# Altium project WS_QTD_v4.0.PrjPcb
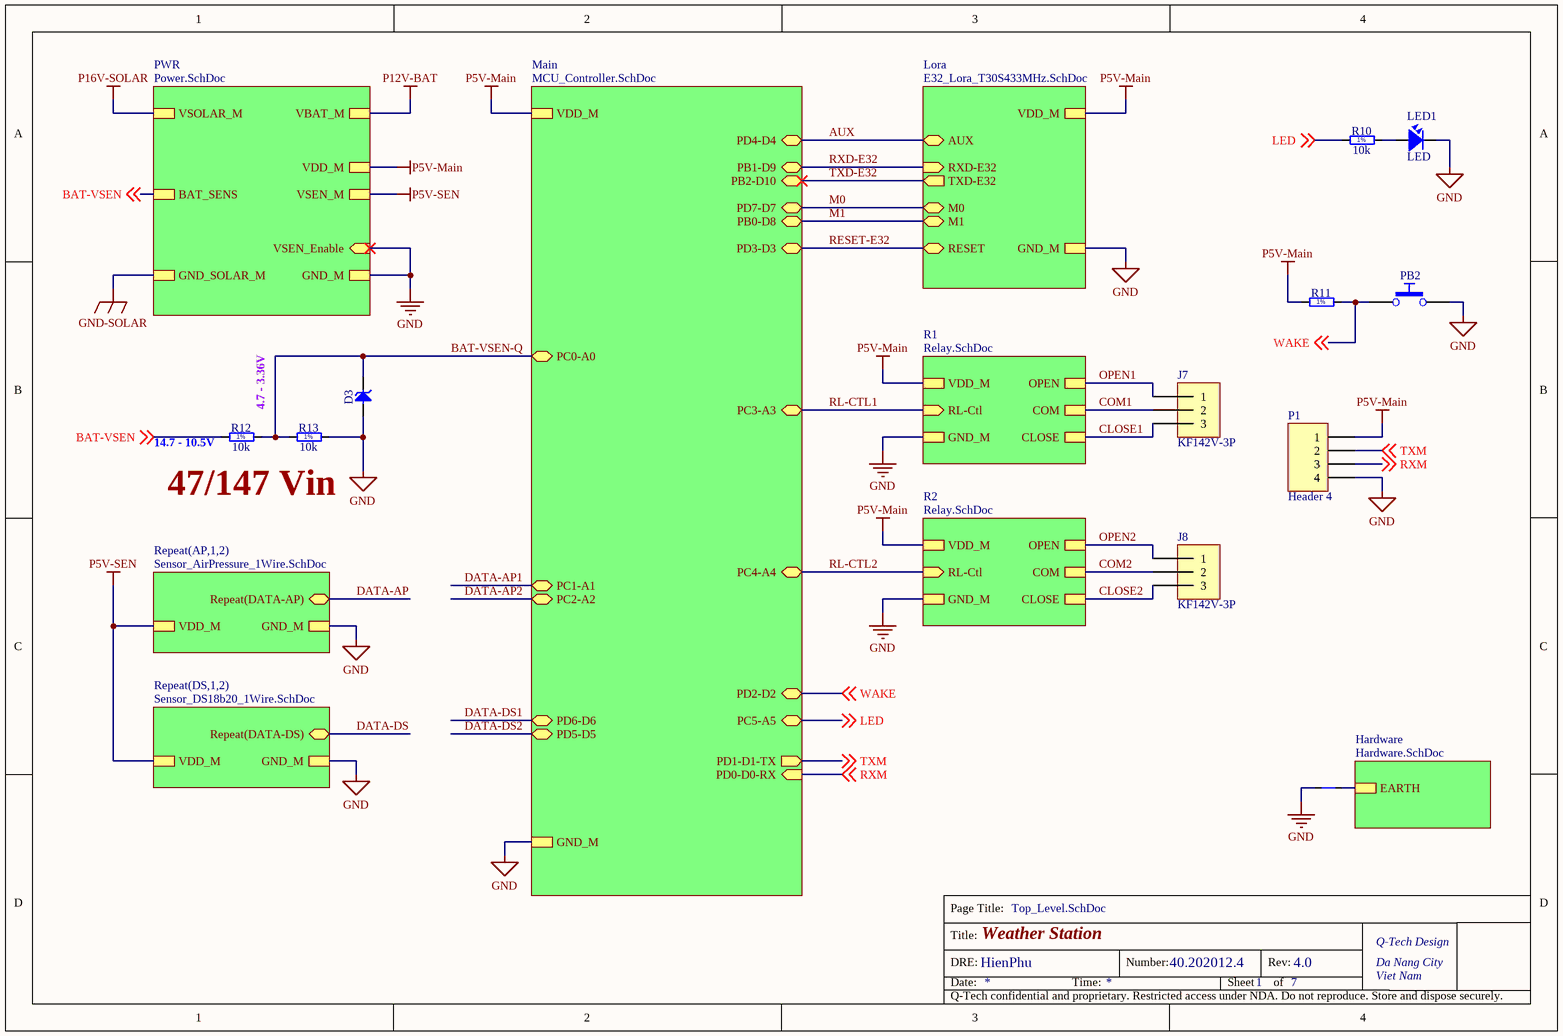
[diagram p0: Top_Level.SchDoc]
DocNumber: 40.202012.4; DRE: HienPhu; ProjectParameterName: Weather Station; Rev: 4.0
8 sheets, 84 parts. Net scope: strictly hierarchical (ports join the sheet entries above them; power ports are local).
Board file: Pcb_WS_v4.PcbDoc
Sheets:
  Top_Level.SchDoc
    Main = MCU_Controller.SchDoc
    Lora = E32_Lora_T30S433MHz.SchDoc
    PWR = Power.SchDoc
    AP1 = Sensor_AirPressure_1Wire.SchDoc
    AP2 = Sensor_AirPressure_1Wire.SchDoc
    DS1 = Sensor_DS18b20_1Wire.SchDoc
    DS2 = Sensor_DS18b20_1Wire.SchDoc
    R1 = Relay.SchDoc
    R2 = Relay.SchDoc
    Hardware = Hardware.SchDoc

## Sheet Top_Level.SchDoc
size A4; Organization: Q-Tech Design; Address1: Da Nang City; Address2: Viet Nam; DocumentNumber: 1; SheetNumber: 1; SheetTotal: 7

### Parts
D3  BZV55-B5V1  [DIOMELF3515N]  (value not drawn)
J7  KF142V-3P  [CON KF142V-3P-5.08]
J8  KF142V-3P  [CON KF142V-3P-5.08]
LED1  LED  [L-0805]
P1  Header 4  [HDR1X4]
PB2  Push Button  [PB_TYCO_FSMSM]  (value not drawn)
R10  10k  [RESC1608X55N]
R11  10k  [RESC1608X55N]  (value not drawn)
R12  10k  [RESC1608X55N]
R13  10k  [RESC1608X55N]
TIE1  TIE  [tie]  (value not drawn)

### Sub-sheets
Hardware = Hardware.SchDoc: EARTH
Lora = E32_Lora_T30S433MHz.SchDoc: M0 (bidir), M1 (bidir), RESET (bidir), AUX (bidir), GND_M, VDD_M, RXD-E32 (in), TXD-E32 (out)
Main = MCU_Controller.SchDoc: PB1-D9 (bidir), PB2-D10 (bidir), GND_M, PC3-A3 (bidir), PB0-D8 (bidir), PD6-D6 (bidir), PD2-D2 (bidir), PC4-A4 (bidir), PD4-D4 (bidir), PC5-A5 (bidir), PC2-A2 (bidir), PD0-D0-RX (in), PD3-D3 (bidir), PC1-A1 (bidir), PD7-D7 (bidir), VDD_M, PD5-D5 (bidir), PC0-A0 (bidir), PD1-D1-TX (out)
PWR = Power.SchDoc: VSOLAR_M, VSEN_Enable (in), BAT_SENS, VSEN_M, GND_SOLAR_M, VBAT_M, GND_M, VDD_M
R1 = Relay.SchDoc: OPEN, GND_M, CLOSE, RL-Ctl (in), VDD_M, COM
R2 = Relay.SchDoc: OPEN, GND_M, CLOSE, RL-Ctl (in), VDD_M, COM
Repeat(AP,1,2) = Sensor_AirPressure_1Wire.SchDoc: VDD_M, GND_M, Repeat(DATA-AP) (bidir)
Repeat(DS,1,2) = Sensor_DS18b20_1Wire.SchDoc: GND_M, Repeat(DATA-DS) (bidir), VDD_M

### Nets
EARTH: TIE1.2 ; sheet Hardware/EARTH
GND: D3.2(A) LED1.2 P1.4 PB2.2 R13.2 TIE1.1 ; sheet Main/GND_M, sheet Lora/GND_M, sheet PWR/VSEN_Enable, sheet PWR/GND_M, sheet Repeat(AP,1,2)/GND_M, sheet Repeat(DS,1,2)/GND_M, sheet R1/GND_M, sheet R2/GND_M
P5V-Main: P1.1 R11.1 ; sheet Main/VDD_M, sheet Lora/VDD_M, sheet PWR/VDD_M, sheet R1/VDD_M, sheet R2/VDD_M
P5V-SEN: sheet PWR/VSEN_M, sheet Repeat(AP,1,2)/VDD_M, sheet Repeat(DS,1,2)/VDD_M
AUX: sheet Main/PD4-D4, sheet Lora/AUX
BAT-VSEN: R12.1 ; off-sheet BAT-VSEN, sheet PWR/BAT_SENS
BAT-VSEN-Q: D3.1(C) R12.2 R13.1 ; sheet Main/PC0-A0
CLOSE1: J7.3 ; sheet R1/CLOSE
CLOSE2: J8.3 ; sheet R2/CLOSE
COM1: J7.2 ; sheet R1/COM
COM2: J8.2 ; sheet R2/COM
DATA-AP: sheet Repeat(AP,1,2)/Repeat(DATA-AP)
DATA-DS: sheet Repeat(DS,1,2)/Repeat(DATA-DS)
LED: R10.1 ; off-sheet LED, sheet Main/PC5-A5
M0: sheet Main/PD7-D7, sheet Lora/M0
M1: sheet Main/PB0-D8, sheet Lora/M1
OPEN1: J7.1 ; sheet R1/OPEN
OPEN2: J8.1 ; sheet R2/OPEN
RESET-E32: sheet Main/PD3-D3, sheet Lora/RESET
RL-CTL1: sheet Main/PC3-A3, sheet R1/RL-Ctl
RL-CTL2: sheet Main/PC4-A4, sheet R2/RL-Ctl
RXD-E32: sheet Main/PB1-D9, sheet Lora/RXD-E32
RXM: P1.3 ; off-sheet RXM, sheet Main/PD0-D0-RX
TXD-E32: sheet Main/PB2-D10, sheet Lora/TXD-E32
TXM: P1.2 ; off-sheet TXM, sheet Main/PD1-D1-TX
WAKE: PB2.1 R11.2 ; off-sheet WAKE, sheet Main/PD2-D2
NetLED1_1: LED1.1 R10.2

### Notes on the sheet
- (near R12) 14.7 - 10.5V
- 4.7 - 3.36V
- 47/147 Vin
- Page Title:
- Date:
- Title:
- DRE:
- Time:
- Number:
- Sheet
- Rev:
- of
- Q-Tech confidential and proprietary. Restricted access under NDA. Do not reproduce. Store and dispose securely.
- (in symbol R0603_1M_1%_0.1W_100PPM) 1%
- (in symbol R0603_2M_1%_0.1W_100PPM) 1%
- (in symbol R0603_10K_1%_0.1W_100PPM) 1%
- (in symbol R0603_200R_1%_0.1W_100PPM) 1%

### Library data of the parts
D3 = BZV55-B5V1: Zener Diode; Part Description: Voltage Regulator Diode; Manufacturer: NXP SEMICONDUCTORS; Voltage: 5V1; Power: 500mW; Table: Diodes; Part Number: BZV55-B5V1; Component Kind: Standard; Component Type: Standard; Device: BZV55-B5V1; PackageDescription: SOD80C, MELF Diode, 2-Leads, Body 3.5x1.5mm, IPC Medium Density; Manufacturer Part Number: BZV55-B5V1; Pin Count: 2; Case: SOD-80C; Mounted: Yes; Socket: No; SMD: Yes; ComponentHeight: 1.6mm; HelpURL: \\cern.ch\dfs\Applications\Altium\Datasheets\BZV55.pdf; Author: CERN DEM JLC; CreateDate: 06-May-08; LatestRevisionDate: 06-May-08
J7 J8 = CON KF142V-3P-5.08
LED1 = LED: LED Single colour Green and Red; Value: LED 3 ly Single Colour
P1 = Header 4: Header, 4-Pin; LatestRevisionDate: 17-Jul-2002; LatestRevisionNote: Re-released for DXP Platform.; Publisher: Altium Limited
PB2 = PB SPST 1NO-2NO: Push-Button Switch SPDT; Part Description: 12VDC 50mA SPST Tactile  Push-Button Switch; Manufacturer: TYCO ELECTRONICS; Manufacturer Part Number: FSMSM or 1437566-3; Table: Switches; Part Number: PB_TYCO_FSMSM; Component Kind: Standard; Component Type: Standard; Pin Count: 2; PackageDescription: Body 3.5x6.0mm, Pushbutton Switch,  TYCO ALCOSWITCH FSMSM Serie; Family: Push Button; Mounted: Yes; Socket: No; SMD: Yes; Status: None; ComponentHeight: 4.3mm; HelpURL: \\cern.ch\dfs\Applications\Altium\Datasheets\PB_TYCO_FSMSM.pdf; Author: CERN DEM JLC; CreateDate: 6/30/2008; LatestRevisionDate: 6/21/2012
R10 = R0603_200R_1%_0.1W_100PPM: Resistor - 1%; Part Description: General Purpose Thick Film Chip Resistor; Manufacturer: GENERIC; Manufacturer1 Part Number: NRC06F2000TRF; Value: 200; Power: 0.1W; TC: ±100ppm/°C; Table: Resistors SMD; Part Number: R0603_200R_1%_0.1W_100PPM; Component Kind: Standard; Component Type: Standard; Pin Count: 2; Status: Preferred; Tolerance: ±1%; Manufacturer Part Number: R0603_200R_1%_0.1W_100PPM; Case: 0603; Mounted: Yes; Socket: No; SMD: Yes; Manufacturer1 Example: NIC COMPONENT; Manufacturer1 ComponentHeight: 0.55mm; HelpURL: \\cern.ch\dfs\Applications\Altium\Datasheets\R0603_NIC_NRC.pdf; Author: CERN DEM JLC; CreateDate: 03-Dec-07; LatestRevisionDate: 13-Mar-08
R11 = R0603_10K_1%_0.1W_100PPM: Resistor - 1%; Part Description: General Purpose Thick Film Chip Resistor; Manufacturer: GENERIC; Manufacturer1 Part Number: NRC06F1002TRF; Power: 0.1W; TC: ±100ppm/°C; Table: Resistors SMD; Part Number: R0603_10K_1%_0.1W_100PPM; Component Kind: Standard; Component Type: Standard; Pin Count: 2; Value: 10k; Status: Preferred; Tolerance: ±1%; Manufacturer Part Number: R0603_10K_1%_0.1W_100PPM; Case: 0603; Mounted: Yes; Socket: No; SMD: Yes; Manufacturer1 Example: NIC COMPONENT; Manufacturer1 ComponentHeight: 0.55mm; HelpURL: \\cern.ch\dfs\Applications\Altium\Datasheets\R0603_NIC_NRC.pdf; Author: CERN DEM JLC; CreateDate: 03-Dec-07; LatestRevisionDate: 13-Mar-08
R12 = R0603_2M_1%_0.1W_100PPM: Resistor - 1%; Part Description: General Purpose Thick Film Chip Resistor; Manufacturer: GENERIC; Manufacturer1 Part Number: NRC06F2004TRF; Value: 2M; Power: 0.1W; TC: ±100ppm/°C; Table: Resistors SMD; Part Number: R0603_2M_1%_0.1W_100PPM; Component Kind: Standard; Component Type: Standard; Pin Count: 2; Status: Preferred; Tolerance: ±1%; Manufacturer Part Number: R0603_2M_1%_0.1W_100PPM; Case: 0603; Mounted: Yes; Socket: No; SMD: Yes; Manufacturer1 Example: NIC COMPONENT; Manufacturer1 ComponentHeight: 0.55mm; HelpURL: \\cern.ch\dfs\Applications\Altium\Datasheets\R0603_NIC_NRC.pdf; Author: CERN DEM JLC; CreateDate: 03-Dec-07; LatestRevisionDate: 13-Mar-08
R13 = R0603_1M_1%_0.1W_100PPM: Resistor - 1%; Part Description: General Purpose Thick Film Chip Resistor; Manufacturer: GENERIC; Manufacturer1 Part Number: NRC06F1004TRF; Value: 1M; Power: 0.1W; TC: ±100ppm/°C; Table: Resistors SMD; Part Number: R0603_1M_1%_0.1W_100PPM; Component Kind: Standard; Component Type: Standard; Pin Count: 2; Status: Preferred; Tolerance: ±1%; Manufacturer Part Number: R0603_1M_1%_0.1W_100PPM; Case: 0603; Mounted: Yes; Socket: No; SMD: Yes; Manufacturer1 Example: NIC COMPONENT; Manufacturer1 ComponentHeight: 0.55mm; HelpURL: \\cern.ch\dfs\Applications\Altium\Datasheets\R0603_NIC_NRC.pdf; Author: CERN DEM JLC; CreateDate: 03-Dec-07; LatestRevisionDate: 13-Mar-08

## Sheet MCU_Controller.SchDoc
size A4; Organization: Q-Tech Design; Address1: Da Nang City; Address2: Viet Nam; DocumentNumber: 2; SheetNumber: 2; SheetTotal: 7
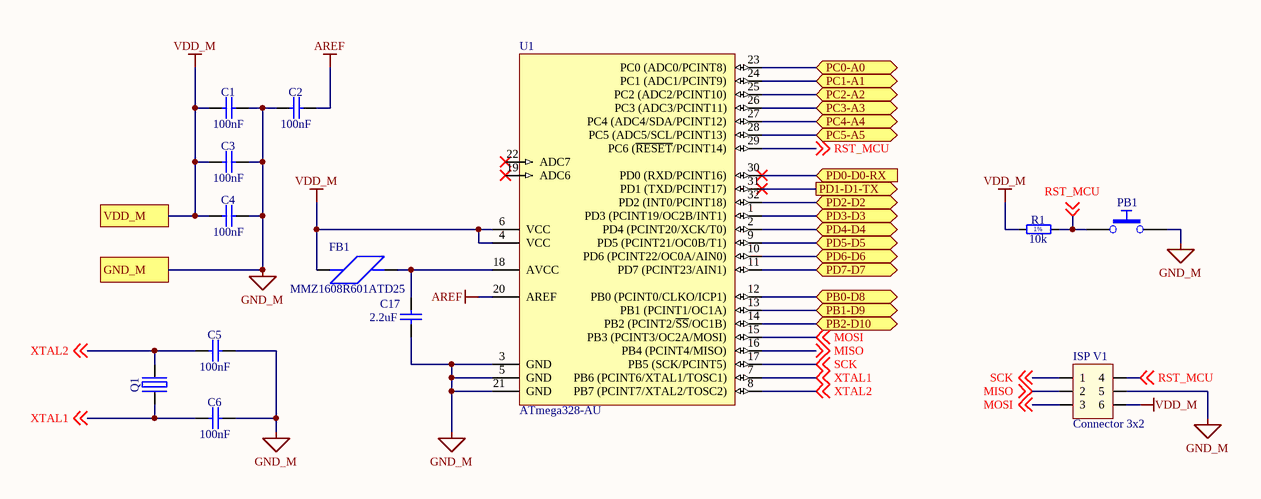
[diagram p1: MCU_Controller.SchDoc]

### Parts
C1  100nF  [CAPC1608X87N]
C2  100nF  [CAPC1608X87N]
C3  100nF  [CAPC1608X87N]
C4  100nF  [CAPC1608X87N]
C5  100nF  [CAPC1608X87N]
C6  100nF  [CAPC1608X87N]
C17  2.2uF  [CAPC1608X87N]
FB1  Manufacturer Part Number: MMZ1608R601ATD25  [Chip_0603]  (hidden comment: Ferrite bead Case 0603)
ISP_V1  Connector 3x2  [JP3x2]
PB1  Push Button  [PB_TYCO_FSMSM]  (value not drawn)
Q1  20MHz  [XTAL_HC-49/U]  (value not drawn)
R1  10k  [RESC1608X55N]
U1  ATmega328-AU  [32A_ATM-M]

### Ports
GND_M, PB0-D8 (bidir), PB1-D9 (bidir), PB2-D10 (bidir), PC0-A0 (bidir), PC1-A1 (bidir), PC2-A2 (bidir), PC3-A3 (bidir), PC4-A4 (bidir), PC5-A5 (bidir), PD0-D0-RX (in), PD1-D1-TX (out), PD2-D2 (bidir), PD3-D3 (bidir), PD4-D4 (bidir), PD5-D5 (bidir), PD6-D6 (bidir), PD7-D7 (bidir), VDD_M

### Nets
AREF: C2.2 U1.20(AREF)
GND_M: C1.2 C2.1 C3.2 C4.2 C5.2 C6.2 C17.1 ISP_V1.5 PB1.2 U1.3(GND) U1.5(GND) U1.21(GND) ; port GND_M  [project net GND]
VDD_M: C1.1 C3.1 C4.1 FB1.1 ISP_V1.6 R1.1 U1.4(VCC) U1.6(VCC) ; port VDD_M  [project net P5V-Main]
AUX: U1.2(PD4_(PCINT20/XCK/T0)) ; port PD4-D4
BAT-VSEN-Q: U1.23(PC0_(ADC0/PCINT8)) ; port PC0-A0
DATA-AP1: U1.24(PC1_(ADC1/PCINT9)) ; port PC1-A1
DATA-AP2: U1.25(PC2_(ADC2/PCINT10)) ; port PC2-A2
DATA-DS1: U1.10(PD6_(PCINT22/OC0A/AIN0)) ; port PD6-D6
DATA-DS2: U1.9(PD5_(PCINT21/OC0B/T1)) ; port PD5-D5
LED: U1.28(PC5_(ADC5/SCL/PCINT13)) ; port PC5-A5
M0: U1.11(PD7_(PCINT23/AIN1)) ; port PD7-D7
M1: U1.12(PB0_(PCINT0/CLKO/ICP1)) ; port PB0-D8
MISO: ISP_V1.2 U1.16(PB4_(PCINT4/MISO)) ; off-sheet MISO
MOSI: ISP_V1.3 U1.15(PB3_(PCINT3/OC2A/MOSI)) ; off-sheet MOSI
RESET-E32: U1.1(PD3_(PCINT19/OC2B/INT1)) ; port PD3-D3
RL-CTL1: U1.26(PC3_(ADC3/PCINT11)) ; port PC3-A3
RL-CTL2: U1.27(PC4_(ADC4/SDA/PCINT12)) ; port PC4-A4
RST_MCU: ISP_V1.4 PB1.1 R1.2 U1.29(PC6_(~{RESET}/PCINT14)) ; off-sheet RST_MCU
RXD-E32: U1.13(PB1_(PCINT1/OC1A)) ; port PB1-D9
RXM: U1.30(PD0_(RXD/PCINT16)) ; port PD0-D0-RX
SCK: ISP_V1.1 U1.17(PB5_(SCK/PCINT5)) ; off-sheet SCK
TXD-E32: U1.14(PB2_(PCINT2/~{SS}/OC1B)) ; port PB2-D10
TXM: U1.31(PD1_(TXD/PCINT17)) ; port PD1-D1-TX
WAKE: U1.32(PD2_(INT0/PCINT18)) ; port PD2-D2
XTAL1: C6.1 Q1.1(OSC1) U1.7(PB6_(PCINT6/XTAL1/TOSC1)) ; off-sheet XTAL1
XTAL2: C5.1 Q1.2(OSC2) U1.8(PB7_(PCINT7/XTAL2/TOSC2)) ; off-sheet XTAL2
NetC17_2: C17.2 FB1.2 U1.18(AVCC)

Not connected (* = marked no-connect by the designer): U1 19(ADC6)* 22(ADC7)*

### Notes on the sheet
- Page Title:
- Date:
- Title:
- DRE:
- Time:
- Number:
- Sheet
- Rev:
- of
- Q-Tech confidential and proprietary. Restricted access under NDA. Do not reproduce. Store and dispose securely.
- (in symbol R0603_10K_1%_0.1W_100PPM) 1%

### Library data of the parts
C1-C4 = CC0603_100NF_50V_10%_X7R: Non-polarised capacitor; Part Description: SMD Multilayer Chip Ceramic Capacitor; Manufacturer: GENERIC; Manufacturer1 Part Number: 223858615649; Voltage: 50V; TC: X7R; Tolerance: ±10%; Table: Capacitors SMD; Part Number: CC0603_100NF_50V_10%_X7R; Component Kind: Standard; Component Type: Standard; Pin Count: 2; Value: 100nF; Status: Preferred; Manufacturer Part Number: CC0603_100NF_50V_10%_X7R; Case: 0603; Mounted: Yes; Socket: No; SMD: Yes; Manufacturer1 Example: PHYCOMP; Manufacturer1 ComponentHeight: 0.87mm; HelpURL: \\cern.ch\dfs\Applications\Altium\Datasheets\CC0603_X7R_PHYCOMP.pdf; Author: CERN DEM JLC; CreateDate: 03-Dec-07; LatestRevisionDate: 03-Dec-07
C5 C6 = CC0603_22PF_50V_5%_NP0: Non-polarised capacitor; Part Description: SMD Multilayer Chip Ceramic Capacitor; Manufacturer: GENERIC; Manufacturer1 Part Number: 223886715229; Value: 22pF; Voltage: 50V; TC: NP0; Tolerance: ±5%; Table: Capacitors SMD; Part Number: CC0603_22PF_50V_5%_NP0; Component Kind: Standard; Component Type: Standard; Pin Count: 2; Status: Preferred; Manufacturer Part Number: CC0603_22PF_50V_5%_NP0; Case: 0603; Mounted: Yes; Socket: No; SMD: Yes; Manufacturer1 Example: PHYCOMP; Manufacturer1 ComponentHeight: 0.87mm; HelpURL: \\cern.ch\dfs\Applications\Altium\Datasheets\CC0603_NP0_PHYCOMP.pdf; Author: CERN DEM JLC; CreateDate: 03-Dec-07; LatestRevisionDate: 03-Dec-07
C17 = CC0603_2.2UF_16V_10%_X5R: Non-polarised capacitor; Part Description: SMD Multilayer Chip Ceramic Capacitor; Manufacturer: GENERIC; Manufacturer1 Part Number: CC0603KRX5R7BB225; Voltage: 16V; TC: X5R; Tolerance: ±10%; Table: Capacitors SMD; Part Number: CC0603_2.2UF_16V_10%_X5R; Component Kind: Standard; Component Type: Standard; Pin Count: 2; Value: 2.2uF; Status: Preferred; Manufacturer Part Number: CC0603_2.2UF_16V_10%_X5R; Case: 0603; Mounted: Yes; Socket: No; SMD: Yes; Manufacturer1 Example: YAGEO; Manufacturer1 ComponentHeight: 0.9mm; HelpURL: \\cern.ch\dfs\Applications\Altium\Datasheets\CC0805_X5R_PHYCOMP_HC.pdf; Author: CERN DEM JLC; CreateDate: 28-Apr-11; LatestRevisionDate: 28-Apr-11
FB1 = FERRITE_0603
ISP_V1 = JP3x2: Value: Connector 3x2
PB1 = PB SPST 1NO-2NO: as PB2 on sheet Top_Level; Part Number: PB_TYCO_FSMSM; Component Kind: Standard; Component Type: Standard; Pin Count: 2; PackageDescription: Body 3.5x6.0mm, Pushbutton Switch,  TYCO ALCOSWITCH FSMSM Serie; Family: Push Button; Mounted: Yes; Socket: No; SMD: Yes; Status: None; ComponentHeight: 4.3mm; HelpURL: \\cern.ch\dfs\Applications\Altium\Datasheets\PB_TYCO_FSMSM.pdf; Author: CERN DEM JLC; CreateDate: 6/30/2008; LatestRevisionDate: 6/21/2012
Q1 = XTAL_20MHZ_AEL_HC-49/U: Quartz Crystal; Part Description: ±30ppm Quartz Crystal Resonator, HC-49/U Type; Manufacturer: AEL CRYSTALS; Manufacturer Part Number: X20M000000L010; Table: Crystals & Oscillators; Part Number: XTAL_20MHZ_AEL_HC-49/U; Component Kind: Standard; Component Type: Standard; PackageDescription: HC-49/U Leaded Cristal, Body 11.05x4.8mm; Pitch 4.88mm; Value: 20MHz; Pin Count: 2; Mounted: Yes; Socket: No; SMD: No; ComponentHeight: 13.6mm; HelpURL: \\cern.ch\dfs\Applications\Altium\Datasheets\XTAL_AEL_HC-49-U.pdf; Author: CERN DEM JMW; CreateDate: 31-Oct-08; LatestRevisionDate: 13-May-11
R1 = R0603_10K_1%_0.1W_100PPM: as R11 on sheet Top_Level; Part Number: R0603_10K_1%_0.1W_100PPM; Component Kind: Standard; Component Type: Standard; Pin Count: 2; Value: 10k; Status: Preferred; Tolerance: ±1%; Manufacturer Part Number: R0603_10K_1%_0.1W_100PPM; Case: 0603; Mounted: Yes; Socket: No; SMD: Yes; Manufacturer1 Example: NIC COMPONENT; Manufacturer1 ComponentHeight: 0.55mm; HelpURL: \\cern.ch\dfs\Applications\Altium\Datasheets\R0603_NIC_NRC.pdf; Author: CERN DEM JLC; CreateDate: 03-Dec-07; LatestRevisionDate: 13-Mar-08
U1 = ATmega328-AU: 8-bit AVR Microcontroller, 32KB Flash, 1KB EEPROM, 2KB SRAM, 32-pin TQFP, Industrial Grade (-40°C to 85°C); Published: 1-Apr-2010; DatasheetVersion: revA, Jan-2010; PackageVersion: revB, Oct-2001; PackageReference: 32A; Publisher: Altium Limited; PackageDescription: 32-Lead, 7x7x1.0 mm Body, 0.8mm Lead Pitch, Thin Profile Plastic Quad Flat Package (TQFP); Supplier 1: Digi-Key; Supplier Part Number 1: ATMEGA328-AU-ND; Supplier 2: Mouser; Supplier Part Number 2: 556-ATMEGA328-AU; Code_JEDEC: MS-026-ABA; ComponentLink1Description: Manufacturer Link; ComponentLink1URL: http://www.atmel.com/products/avr/default.asp?; ComponentLink2Description: ATmega48A/48PA/88A/88PA/168A/168PA/328/328P Datasheet; ComponentLink2URL: http://www.atmel.com/dyn/resources/prod_documents/8271.pdf; ComponentLink3Description: ATmega48A/48PA/88A/88PA/168A/168PA/328/328P Summary; ComponentLink3URL: http://www.atmel.com/dyn/resources/prod_documents/8271S.pdf; ComponentLink4Description: Atmel.com Home; ComponentLink4URL: http://www.atmel.com

## Sheet E32_Lora_T30S433MHz.SchDoc
size A4; Organization: Q-Tech Design; Address1: Da Nang City; Address2: Viet Nam; DocumentNumber: 3; SheetNumber: 3; SheetTotal: 7
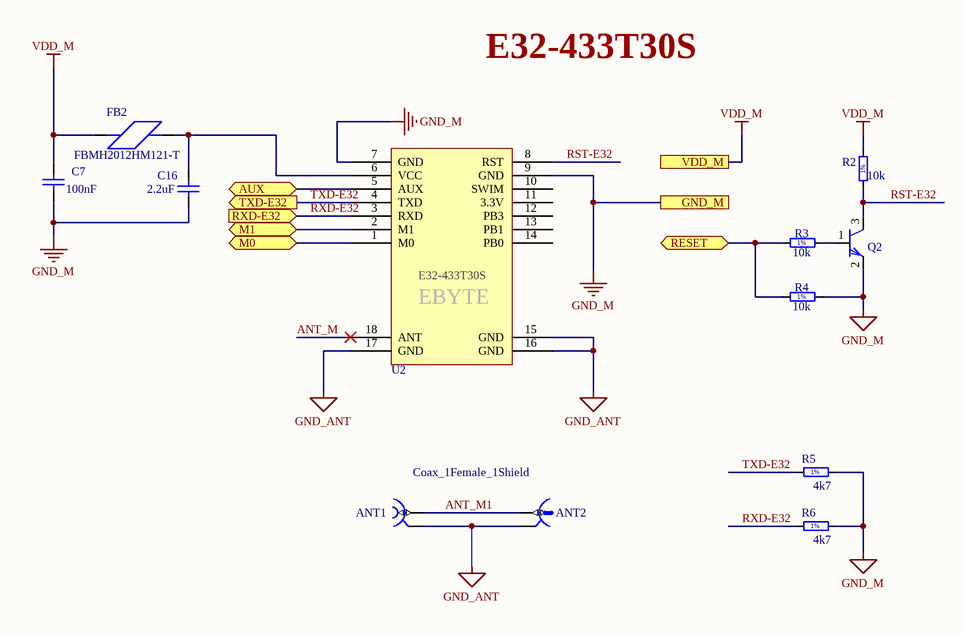
[diagram p2: E32_Lora_T30S433MHz.SchDoc]

### Parts
ANT1  Coax_1Female_1Shield  [HUBER-SUHNER_85 SMA-50-0-101/111 NE]
ANT2  U.FL  [HIROSE_U.FL-R-SMT-1(10)]  (value not drawn)
C7  100nF  [CAPC1608X87N]
C16  2.2uF  [CAPC1608X87N]
FB2  Manufacturer Part Number: FBMH2012HM121-T  [CHIP_0805]  (hidden comment: Ferrite bead Case 0805)
Q2  C1815  [SOT23-3]  (value not drawn)
R2  10k  [RESC1608X55N]
R3  10k  [RESC1608X55N]
R4  10k  [RESC1608X55N]
R5  4k7  [RESC1608X55N]
R6  4k7  [RESC1608X55N]
U2  E32-T30S  [E32-T30S]  (value not drawn)

### Ports
AUX (bidir), GND_M, M0 (bidir), M1 (bidir), RESET (bidir), RXD-E32 (in), TXD-E32 (out), VDD_M

### Nets
GND_ANT: ANT1.2 ANT2.2 U2.15(GND) U2.16(GND) U2.17(GND)
GND_M: C7.1 C16.1 Q2.2(E) R4.1 R5.2 R6.2 U2.7(GND) U2.9(GND) ; port GND_M  [project net GND]
VDD_M: C7.2 FB2.1 R2.2 ; port VDD_M  [project net P5V-Main]
ANT_M: U2.18(ANT)
ANT_M1: ANT1.1 ANT2.1
AUX: U2.5(AUX) ; port AUX
M0: U2.1(M0) ; port M0
M1: U2.2(M1) ; port M1
RESET-E32: R3.1 R4.2 ; port RESET
RST-E32: Q2.3(C) R2.1 U2.8(RST)
RXD-E32: R6.1 U2.3(RXD) ; port RXD-E32
TXD-E32: R5.1 U2.4(TXD) ; port TXD-E32
NetC16_2: C16.2 FB2.2 U2.6(VCC)
NetQ2_1: Q2.1(B) R3.2

Not connected (* = marked no-connect by the designer): U2 10(SWIM) 11(3.3V) 12(PB3) 13(PB1) 14(PB0)

### Notes on the sheet
- E32-433T30S
- Page Title:
- Date:
- Title:
- DRE:
- Time:
- Number:
- Sheet
- Rev:
- of
- Q-Tech confidential and proprietary. Restricted access under NDA. Do not reproduce. Store and dispose securely.
- (in symbol E32-433T30S) EBYTE
- (in symbol R0603_1K_1%_0.1W_100PPM) 1%
- (in symbol R0603_4K7_1%_0.1W_100PPM) 1%
- (in symbol R0603_10K_1%_0.1W_100PPM) 1%

### Library data of the parts
ANT1 = HUBER-SUHNER_85_SMA-50-0-101/111_NE: Part Description: SMA 50 Ohms Right Angle PCB Jack; Manufacturer: HUBER+SUHNER; Table: Miscellaneous; Part Number: HUBER-SUHNER_85_SMA-50-0-101/111_NE; Component Kind: Standard; Component Type: Standard; Pin Count: 2; Family: SMA; Mounted: Yes; Socket: No; SMD: No; Status: None; Manufacturer Part Number: 85_SMA-50-0-101/111_NE; ComponentHeight: 9.6mm; HelpURL: \\cern.ch\dfs\Applications\Altium\Datasheets\HUBER-SUHNER_85 SMA-50-0-101-111 NE.pdf; Author: CERN DEM JLC; CreateDate: 20-Apr-10; LatestRevisionDate: 27-Apr-10
ANT2 = HIROSE_U.FL-R-SMT-1(10): Part Description: Up to 6GHz Ultra Small Surface Mount Male Coaxial Connectors U.FL Series; Manufacturer: HIROSE (HRS); Table: Miscellaneous; Part Number: HIROSE_U.FL-R-SMT-1(10); Component Kind: Standard; Component Type: Standard; Pin Count: 2; Family: U.FL; Mounted: Yes; Socket: No; SMD: Yes; Status: None; Manufacturer Part Number: U.FL-R-SMT-1(10); ComponentHeight: 1.25mm; HelpURL: \\cern.ch\dfs\Applications\Altium\Datasheets\HIROSE_U.FL-R-SMT-1(10).pdf; Author: CERN DEM JLC; CreateDate: 24-Mar-10; LatestRevisionDate: 24-Mar-10
C7 = CC0603_100NF_50V_10%_X7R: as C1 on sheet MCU_Controller; Part Number: CC0603_100NF_50V_10%_X7R; Component Kind: Standard; Component Type: Standard; Pin Count: 2; Value: 100nF; Status: Preferred; Manufacturer Part Number: CC0603_100NF_50V_10%_X7R; Case: 0603; Mounted: Yes; Socket: No; SMD: Yes; Manufacturer1 Example: PHYCOMP; Manufacturer1 ComponentHeight: 0.87mm; HelpURL: \\cern.ch\dfs\Applications\Altium\Datasheets\CC0603_X7R_PHYCOMP.pdf; Author: CERN DEM JLC; CreateDate: 03-Dec-07; LatestRevisionDate: 03-Dec-07
C16 = CC0603_2.2UF_16V_10%_X5R: as C17 on sheet MCU_Controller; Part Number: CC0603_2.2UF_16V_10%_X5R; Component Kind: Standard; Component Type: Standard; Pin Count: 2; Value: 2.2uF; Status: Preferred; Manufacturer Part Number: CC0603_2.2UF_16V_10%_X5R; Case: 0603; Mounted: Yes; Socket: No; SMD: Yes; Manufacturer1 Example: YAGEO; Manufacturer1 ComponentHeight: 0.9mm; HelpURL: \\cern.ch\dfs\Applications\Altium\Datasheets\CC0805_X5R_PHYCOMP_HC.pdf; Author: CERN DEM JLC; CreateDate: 28-Apr-11; LatestRevisionDate: 28-Apr-11
FB2 = FERRITE_0805
Q2 = 2SC1815: PSpiceTemplate: Q^@REFDES %c %b %e @MODEL; Vendor: Digikey; COMPONENT: 2SC1815; Published: 13-April-2009; Publisher: Hoang Nguyen; ComponentLink1Description: Digikey Part Link; ComponentLink2Description: Open Datasheet; ComponentLink2URL: H:\LIBRARY\LIBRARY.Datasheet\; Price: 500VND
R2 = R0603_4K7_1%_0.1W_100PPM: Resistor - 1%; Part Description: General Purpose Thick Film Chip Resistor; Manufacturer: GENERIC; Manufacturer1 Part Number: NRC06F4701TRF; Value: 4k7; Power: 0.1W; TC: ±100ppm/°C; Table: Resistors SMD; Part Number: R0603_4K7_1%_0.1W_100PPM; Component Kind: Standard; Component Type: Standard; Pin Count: 2; Status: Preferred; Tolerance: ±1%; Manufacturer Part Number: R0603_4K7_1%_0.1W_100PPM; Case: 0603; Mounted: Yes; Socket: No; SMD: Yes; Manufacturer1 Example: NIC COMPONENT; Manufacturer1 ComponentHeight: 0.55mm; HelpURL: \\cern.ch\dfs\Applications\Altium\Datasheets\R0603_NIC_NRC.pdf; Author: CERN DEM JLC; CreateDate: 03-Dec-07; LatestRevisionDate: 13-Mar-08
R3 R4 = R0603_1K_1%_0.1W_100PPM: Resistor - 1%; Part Description: General Purpose Thick Film Chip Resistor; Manufacturer: GENERIC; Manufacturer1 Part Number: NRC06F1001TRF; Value: 1k; Power: 0.1W; TC: ±100ppm/°C; Table: Resistors SMD; Part Number: R0603_1K_1%_0.1W_100PPM; Component Kind: Standard; Component Type: Standard; Pin Count: 2; Status: Preferred; Tolerance: ±1%; Manufacturer Part Number: R0603_1K_1%_0.1W_100PPM; Case: 0603; Mounted: Yes; Socket: No; SMD: Yes; Manufacturer1 Example: NIC COMPONENT; Manufacturer1 ComponentHeight: 0.55mm; HelpURL: \\cern.ch\dfs\Applications\Altium\Datasheets\R0603_NIC_NRC.pdf; Author: CERN DEM JLC; CreateDate: 03-Dec-07; LatestRevisionDate: 13-Mar-08
R5 R6 = R0603_10K_1%_0.1W_100PPM: Resistor - 1%; Part Description: General Purpose Thick Film Chip Resistor; Manufacturer: GENERIC; Manufacturer1 Part Number: NRC06F1002TRF; Value: 10k; Power: 0.1W; TC: ±100ppm/°C; Table: Resistors SMD; Part Number: R0603_10K_1%_0.1W_100PPM; Component Kind: Standard; Component Type: Standard; Pin Count: 2; Status: Preferred; Tolerance: ±1%; Manufacturer Part Number: R0603_10K_1%_0.1W_100PPM; Case: 0603; Mounted: Yes; Socket: No; SMD: Yes; Manufacturer1 Example: NIC COMPONENT; Manufacturer1 ComponentHeight: 0.55mm; HelpURL: \\cern.ch\dfs\Applications\Altium\Datasheets\R0603_NIC_NRC.pdf; Author: CERN DEM JLC; CreateDate: 03-Dec-07; LatestRevisionDate: 13-Mar-08
U2 = E32-433T30S: Lora Ebyte E32-T30S Module

## Sheet Power.SchDoc
size A4; Organization: Q-Tech Design; Address1: Da Nang City; Address2: Viet Nam; DocumentNumber: 7; SheetNumber: 7; SheetTotal: 7
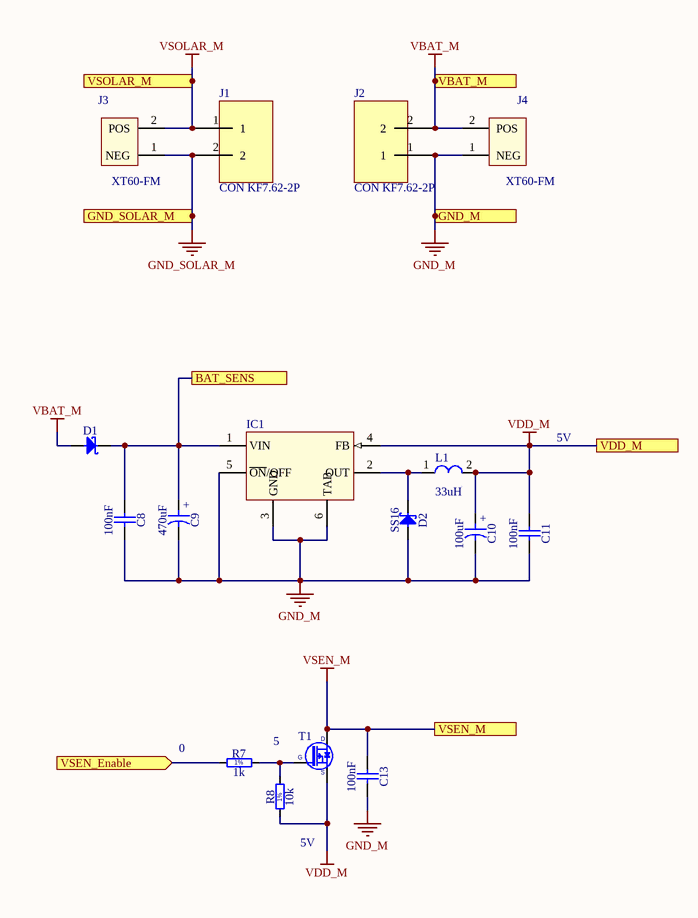
[diagram p3: Power.SchDoc]

### Parts
C8  100nF  [CAPC1608X87N]
C9  470uF  [CAPAE1030X1020N]
C10  100uF  [CAPMP6032X280N]
C11  100nF  [CAPC1608X87N]
C13  100nF  [CAPC1608X87N]
D1  SS16  [DIOM5127X229N]  (value not drawn)
D2  SS16  [DIOM5127X229N]
IC1  LM2596  [TO263-5]  (value not drawn)
J1  CON KF7.62-2P  [CON KF7.62-2P]
J2  CON KF7.62-2P  [CON KF7.62-2P]
J3  XT60-FM  [XT60-FM]
J4  XT60-FM  [XT60-FM]
L1  33uH  [L_SMD]
R7  1k  [RESC1608X55N]
R8  10k  [RESC1608X55N]
T1  BSH203  [SOT95P230X110-3N]  (value not drawn)

### Ports
BAT_SENS, GND_M, GND_SOLAR_M, VBAT_M, VDD_M, VSEN_Enable (in), VSEN_M, VSOLAR_M

### Nets
GND_M: C8.2 C9.2 C10.2 C11.2 C13.2 D2.2(A) IC1.3(GND) IC1.5(~{ON}/OFF) IC1.6(TAB) J2.1 J4.1(NEG) R7.1 ; port GND_M, port VSEN_Enable  [project net GND]
GND_SOLAR_M: J1.2 J3.1(NEG) ; port GND_SOLAR_M  [project net GND-SOLAR]
VBAT_M: D1.2(A) J2.2 J4.2(POS) ; port VBAT_M  [project net P12V-BAT]
VDD_M: C10.1 C11.1 IC1.4(FB) L1.2 R8.1 T1.2(S) ; port VDD_M  [project net P5V-Main]
VSEN_M: C13.1 T1.3(D) ; port VSEN_M  [project net P5V-SEN]
VSOLAR_M: J1.1 J3.2(POS) ; port VSOLAR_M  [project net P16V-SOLAR]
BAT-VSEN: C8.1 C9.1 D1.1(C) IC1.1(VIN) ; port BAT_SENS
NetD2_1: D2.1(C) IC1.2(OUT) L1.1
NetR7_2: R7.2 R8.2 T1.1(G)

### Notes on the sheet
- 5V
- 5
- (near R7) 0
- (near R8) 5V
- Page Title:
- Date:
- Title:
- DRE:
- Time:
- Number:
- Sheet
- Rev:
- of
- Q-Tech confidential and proprietary. Restricted access under NDA. Do not reproduce. Store and dispose securely.
- (in symbol CAE1030-1020_470UF_25V_20%) +
- (in symbol CTE6032-28_100UF_6.3V_10%_LESR0075) +
- (in symbol R0603_1K_1%_0.1W_100PPM) 1%
- (in symbol R0603_10K_1%_0.1W_100PPM) 1%

### Library data of the parts
C8 C11 C13 = CC0603_100NF_50V_10%_X7R: as C1 on sheet MCU_Controller; Part Number: CC0603_100NF_50V_10%_X7R; Component Kind: Standard; Component Type: Standard; Pin Count: 2; Value: 100nF; Status: Preferred; Manufacturer Part Number: CC0603_100NF_50V_10%_X7R; Case: 0603; Mounted: Yes; Socket: No; SMD: Yes; Manufacturer1 Example: PHYCOMP; Manufacturer1 ComponentHeight: 0.87mm; HelpURL: \\cern.ch\dfs\Applications\Altium\Datasheets\CC0603_X7R_PHYCOMP.pdf; Author: CERN DEM JLC; CreateDate: 03-Dec-07; LatestRevisionDate: 03-Dec-07
C9 = CAE1030-1020_470UF_25V_20%: Polarised capacitor; Part Description: Aluminum Electrolytic SMT Capacitor; Manufacturer: GENERIC; Manufacturer1 Part Number: EEEFK1E471AP; Voltage: 25V; Tolerance: ±20%; Table: Capacitors SMD; Part Number: CAE1030-1020_470UF_25V_20%; Component Kind: Standard; Component Type: Standard; Pin Count: 2; Value: 470uF; Status: Not Recommended; Manufacturer Part Number: CAE1030-1020_470UF_25V_20%; Case: G; Mounted: Yes; Socket: No; SMD: Yes; Manufacturer1 Example: PANASONIC; Manufacturer1 ComponentHeight: 10.2mm; HelpURL: \\cern.ch\dfs\Applications\Altium\Datasheets\CAE_PANASONIC_FK.pdf; Author: CERN DEM JLC; CreateDate: 03-Dec-07; LatestRevisionDate: 03-Dec-07
C10 = CTE6032-28_100UF_6.3V_10%_LESR0075: Polarised capacitor; Part Description: Low ESR 0R075 Solid Tantalum Chip Capacitor; Manufacturer: GENERIC; Manufacturer1 Part Number: TPSC107K006R0075; Voltage: 6.3V; Tolerance: ±10%; Table: Capacitors SMD; Part Number: CTE6032-28_100UF_6.3V_10%_LESR0075; Component Kind: Standard; Component Type: Standard; Pin Count: 2; Value: 100uF; Status: Preferred; Manufacturer Part Number: CTE6032-28_100UF_6.3V_10%_LESR0075; Case: C; Mounted: Yes; Socket: No; SMD: Yes; Manufacturer1 Example: AVX; Manufacturer1 ComponentHeight: 2.8mm; HelpURL: \\cern.ch\dfs\Applications\Altium\Datasheets\CTE-LESR_AVX_TPS.pdf; Author: CERN DEM JLC; CreateDate: 05-May-08; LatestRevisionDate: 20-Jan-09
D1 D2 = SS16: Schottky Diode; Part Description: Surface Mount Schottky Barrier Rectifier; Manufacturer: VISHAY GENERAL SEMICONDUCTOR; Voltage: 60V; Power: 1A; Table: Diodes; Part Number: SS16; Component Kind: Standard; Component Type: Standard; Device: SS16; PackageDescription: DO-214-AC Molded Diode, Body 5.1x2.7mm, IPC Medium Density; Manufacturer Part Number: SS16; Pin Count: 2; Case: DO-214AC; Mounted: Yes; Socket: No; SMD: Yes; ComponentHeight: 2.29mm; HelpURL: \\cern.ch\dfs\Applications\Altium\Datasheets\SS16.pdf; Author: CERN DEM JLC; CreateDate: 15-Jul-08; LatestRevisionDate: 23-Aug-10
IC1 = LM2596-5V
J3 J4 = XT60-FM: MF: AMASS; MP: XT60-M; SnapEDA_Link: https://www.snapeda.com/parts/XT60-M/AMASS/view-part/?ref=snap; Price: None; Availability: Unavailable; Package: Package Analog Devices; Value: *
L1 = L_SMD 33uH
R7 = R0603_1K_1%_0.1W_100PPM: Resistor - 1%; Part Description: General Purpose Thick Film Chip Resistor; Manufacturer: GENERIC; Manufacturer1 Part Number: NRC06F1001TRF; Power: 0.1W; TC: ±100ppm/°C; Table: Resistors SMD; Part Number: R0603_1K_1%_0.1W_100PPM; Component Kind: Standard; Component Type: Standard; Pin Count: 2; Value: 1k; Status: Preferred; Tolerance: ±1%; Manufacturer Part Number: R0603_1K_1%_0.1W_100PPM; Case: 0603; Mounted: Yes; Socket: No; SMD: Yes; Manufacturer1 Example: NIC COMPONENT; Manufacturer1 ComponentHeight: 0.55mm; HelpURL: \\cern.ch\dfs\Applications\Altium\Datasheets\R0603_NIC_NRC.pdf; Author: CERN DEM JLC; CreateDate: 03-Dec-07; LatestRevisionDate: 13-Mar-08
R8 = R0603_10K_1%_0.1W_100PPM: as R11 on sheet Top_Level; Part Number: R0603_10K_1%_0.1W_100PPM; Component Kind: Standard; Component Type: Standard; Pin Count: 2; Value: 10k; Status: Preferred; Tolerance: ±1%; Manufacturer Part Number: R0603_10K_1%_0.1W_100PPM; Case: 0603; Mounted: Yes; Socket: No; SMD: Yes; Manufacturer1 Example: NIC COMPONENT; Manufacturer1 ComponentHeight: 0.55mm; HelpURL: \\cern.ch\dfs\Applications\Altium\Datasheets\R0603_NIC_NRC.pdf; Author: CERN DEM JLC; CreateDate: 03-Dec-07; LatestRevisionDate: 13-Mar-08
T1 = BSH203: P-CHANNEL MOSFET WITH DIODE; Part Description: -30V -470mA P-Channel Enhancement Mode MOS Transistor; Manufacturer: NXP SEMICONDUCTORS; Table: Transistors; Part Number: BSH203; Component Kind: Standard; Component Type: Standard; Device: BSH203; PackageDescription: SOT23, 3 pin, Pitch 0.95mm - 1.3mm W X 2.9mm L X 1.1mm H, IPC Medium Density; Manufacturer Part Number: BSH203; Pin Count: 3; Case: SOT23-3; Mounted: Yes; Socket: No; SMD: Yes; ComponentHeight: 1.1mm; HelpURL: \\cern.ch\dfs\Applications\Altium\Datasheets\BSH203.pdf; Author: CERN DEM JLC; CreateDate: 10-May-10; LatestRevisionDate: 10-May-10

## Sheet Sensor_AirPressure_1Wire.SchDoc
size A4; Organization: Q-Tech Design; Address1: Da Nang City; Address2: Viet Nam; DocumentNumber: 4; SheetNumber: 4; SheetTotal: 7
Used 2 times, as channels AP1, AP2. Parts and nets are listed once, with the designators drawn on the sheet.
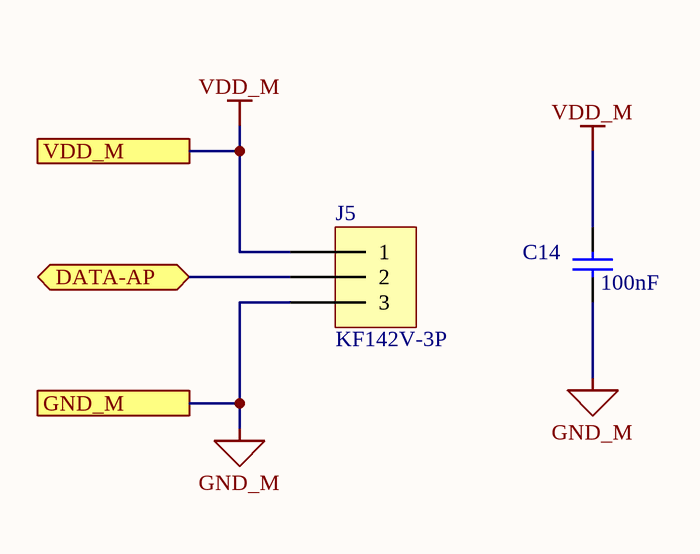
[diagram p4: Sensor_AirPressure_1Wire.SchDoc]

### Parts
C14  100nF  [CAPC1608X87N]
J5  KF142V-3P  [CON KF142V-3P-5.08]

### Ports
DATA-AP (bidir), GND_M, VDD_M

### Nets
GND_M: C14.1 J5.3 ; port GND_M
VDD_M: C14.2 J5.1 ; port VDD_M
DATA-AP: J5.2 ; port DATA-AP

### Channels
AP1: designators end in AP1; ports DATA-AP=DATA-AP1 GND_M=GND VDD_M=P5V-SEN
AP2: designators end in AP2; ports DATA-AP=DATA-AP2 GND_M=GND VDD_M=P5V-SEN

### Notes on the sheet
- Page Title:
- Date:
- Title:
- DRE:
- Time:
- Number:
- Sheet
- Rev:
- of
- Q-Tech confidential and proprietary. Restricted access under NDA. Do not reproduce. Store and dispose securely.

### Library data of the parts
C14 = CC0603_100NF_50V_10%_X7R: as C1 on sheet MCU_Controller; Part Number: CC0603_100NF_50V_10%_X7R; Component Kind: Standard; Component Type: Standard; Pin Count: 2; Value: 100nF; Status: Preferred; Manufacturer Part Number: CC0603_100NF_50V_10%_X7R; Case: 0603; Mounted: Yes; Socket: No; SMD: Yes; Manufacturer1 Example: PHYCOMP; Manufacturer1 ComponentHeight: 0.87mm; HelpURL: \\cern.ch\dfs\Applications\Altium\Datasheets\CC0603_X7R_PHYCOMP.pdf; Author: CERN DEM JLC; CreateDate: 03-Dec-07; LatestRevisionDate: 03-Dec-07
J5 = CON KF142V-3P-5.08

## Sheet Sensor_DS18b20_1Wire.SchDoc
size A4; Organization: Q-Tech Design; Address1: Da Nang City; Address2: Viet Nam; DocumentNumber: 5; SheetNumber: 5; SheetTotal: 7
Used 2 times, as channels DS1, DS2. Parts and nets are listed once, with the designators drawn on the sheet.
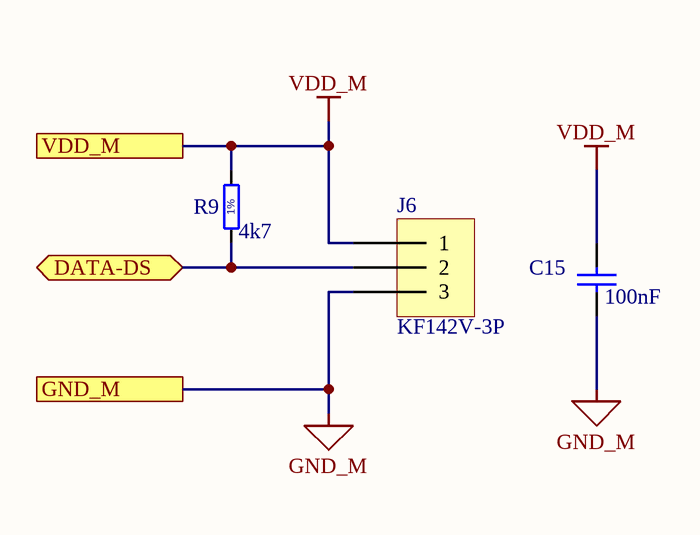
[diagram p5: Sensor_DS18b20_1Wire.SchDoc]

### Parts
C15  100nF  [CAPC1608X87N]
J6  KF142V-3P  [CON KF142V-3P-5.08]
R9  4k7  [RESC1608X55N]

### Ports
DATA-DS (bidir), GND_M, VDD_M

### Nets
GND_M: C15.1 J6.3 ; port GND_M
VDD_M: C15.2 J6.1 R9.2 ; port VDD_M
DATA-DS: J6.2 R9.1 ; port DATA-DS

### Channels
DS1: designators end in DS1; ports DATA-DS=DATA-DS1 GND_M=GND VDD_M=P5V-SEN
DS2: designators end in DS2; ports DATA-DS=DATA-DS2 GND_M=GND VDD_M=P5V-SEN

### Notes on the sheet
- Page Title:
- Date:
- Title:
- DRE:
- Time:
- Number:
- Sheet
- Rev:
- of
- Q-Tech confidential and proprietary. Restricted access under NDA. Do not reproduce. Store and dispose securely.
- (in symbol R0603_4K7_1%_0.1W_100PPM) 1%

### Library data of the parts
C15 = CC0603_100NF_50V_10%_X7R: as C1 on sheet MCU_Controller; Part Number: CC0603_100NF_50V_10%_X7R; Component Kind: Standard; Component Type: Standard; Pin Count: 2; Value: 100nF; Status: Preferred; Manufacturer Part Number: CC0603_100NF_50V_10%_X7R; Case: 0603; Mounted: Yes; Socket: No; SMD: Yes; Manufacturer1 Example: PHYCOMP; Manufacturer1 ComponentHeight: 0.87mm; HelpURL: \\cern.ch\dfs\Applications\Altium\Datasheets\CC0603_X7R_PHYCOMP.pdf; Author: CERN DEM JLC; CreateDate: 03-Dec-07; LatestRevisionDate: 03-Dec-07
J6 = CON KF142V-3P-5.08
R9 = R0603_4K7_1%_0.1W_100PPM: Resistor - 1%; Part Description: General Purpose Thick Film Chip Resistor; Manufacturer: GENERIC; Manufacturer1 Part Number: NRC06F4701TRF; Power: 0.1W; TC: ±100ppm/°C; Table: Resistors SMD; Part Number: R0603_4K7_1%_0.1W_100PPM; Component Kind: Standard; Component Type: Standard; Pin Count: 2; Value: 4k7; Status: Preferred; Tolerance: ±1%; Manufacturer Part Number: R0603_4K7_1%_0.1W_100PPM; Case: 0603; Mounted: Yes; Socket: No; SMD: Yes; Manufacturer1 Example: NIC COMPONENT; Manufacturer1 ComponentHeight: 0.55mm; HelpURL: \\cern.ch\dfs\Applications\Altium\Datasheets\R0603_NIC_NRC.pdf; Author: CERN DEM JLC; CreateDate: 03-Dec-07; LatestRevisionDate: 13-Mar-08

## Sheet Relay.SchDoc
size A4; Organization: Q-Tech Design; Address1: Da Nang City; Address2: Viet Nam; DocumentNumber: 6; SheetNumber: 6; SheetTotal: 7
Used 2 times, as channels R1, R2. Parts and nets are listed once, with the designators drawn on the sheet.
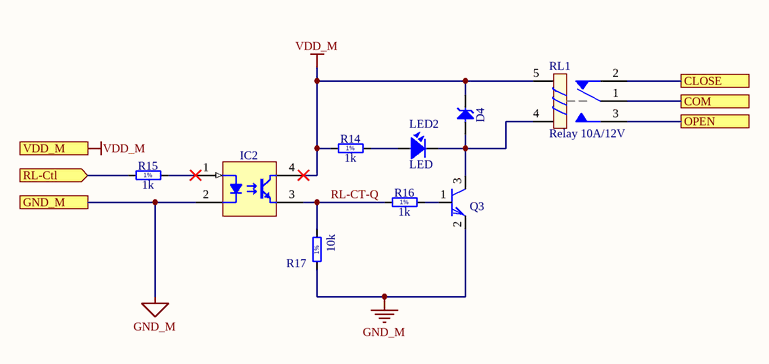
[diagram p6: Relay.SchDoc]

### Parts
D4  BZG03C220  [DIOM5326X230N]  (value not drawn)
IC2  SFH6156-4  [SOIC254P977X406-4N]  (value not drawn)
LED2  LED  [L-0805]
Q3  C1815  [SOT23-3]  (value not drawn)
R14  1k  [RESC1608X55N]
R15  1k  [RESC1608X55N]
R16  1k  [RESC1608X55N]
R17  10k  [RESC1608X55N]
RL1  Relay 10A/12V  [RL_SPDT_10A]

### Ports
CLOSE, COM, GND_M, OPEN, RL-Ctl (in), VDD_M

### Nets
GND_M: IC2.2(C) Q3.2(E) R17.1 ; port GND_M
VDD_M: D4.1(C) IC2.4(C) R14.1 RL1.5 ; port VDD_M
CLOSE: RL1.2 ; port CLOSE
COM: RL1.1 ; port COM
OPEN: RL1.3 ; port OPEN
RL-CT-Q: IC2.3(E) R16.1 R17.2
RL-Ctl: R15.1 ; port RL-Ctl
NetD4_2: D4.2(A) LED2.2 Q3.3(C) RL1.4
NetIC2_1: IC2.1(A) R15.2
NetLED2_1: LED2.1 R14.2
NetQ3_1: Q3.1(B) R16.2

### Channels
R1: designators end in R1; ports CLOSE=CLOSE1 COM=COM1 GND_M=GND OPEN=OPEN1 RL-Ctl=RL-CTL1 VDD_M=P5V-Main
R2: designators end in R2; ports CLOSE=CLOSE2 COM=COM2 GND_M=GND OPEN=OPEN2 RL-Ctl=RL-CTL2 VDD_M=P5V-Main

### Notes on the sheet
- Page Title:
- Date:
- Title:
- DRE:
- Time:
- Number:
- Sheet
- Rev:
- of
- Q-Tech confidential and proprietary. Restricted access under NDA. Do not reproduce. Store and dispose securely.
- (in symbol R0603_1K_1%_0.1W_100PPM) 1%
- (in symbol R0603_10K_1%_0.1W_100PPM) 1%
- (in symbol R0603_200R_1%_0.1W_100PPM) 1%

### Library data of the parts
D4 = BZG03C220: Zener Diode; Part Description: Voltage Regulator Diode; Manufacturer: VISHAY SEMICONDUCTOR; Voltage: 220V; Power: 1.25W; Table: Diodes; Part Number: BZG03C220; Component Kind: Standard; Component Type: Standard; Device: BZG03C220; PackageDescription: DO-214-AC/SMA Molded Diode, Body 5.3x2.6mm, IPC Medium Density; Manufacturer Part Number: BZG03C220; Pin Count: 2; Case: DO-214AC; Mounted: Yes; Socket: No; SMD: Yes; ComponentHeight: 2.3mm; HelpURL: \\cern.ch\dfs\Applications\Altium\Datasheets\BZG03C.pdf; Author: CERN DEM JLC; CreateDate: 6/2/2008; LatestRevisionDate: 6/2/2008
IC2 = SFH6156-4: Single Optocoupler; Part Description: Optocoupler, Phototransistor Output, High Reliability, 5300 VRMS; Manufacturer: VISHAY SEMICONDUCTORS; Table: Optocouplers; Part Number: SFH6156-4; Component Kind: Standard; Component Type: Standard; Device: SFH6156-4; PackageDescription: SOIC, 2.54mm pitch; 4 pin, 6.65mm W X 4.69mm L, IPC Medium Density; Manufacturer Part Number: SFH6156-4; Pin Count: 4; Case: SOIC4; Mounted: Yes; Socket: No; SMD: Yes; ComponentHeight: 4.06mm; HelpURL: \\cern.ch\dfs\Applications\Altium\Datasheets\SFH6156-4.pdf; Author: CERN DEM JMW; CreateDate: 22-Jul-09; LatestRevisionDate: 22-Jul-09
LED2 = LED: as LED1 on sheet Top_Level
Q3 = 2SC1815: as Q2 on sheet E32_Lora_T30S433MHz; COMPONENT: 2SC1815; Published: 13-April-2009; Publisher: Hoang Nguyen; ComponentLink1Description: Digikey Part Link; ComponentLink2Description: Open Datasheet; ComponentLink2URL: H:\LIBRARY\LIBRARY.Datasheet\; Price: 500VND
R14 R16 = R0603_200R_1%_0.1W_100PPM: as R10 on sheet Top_Level; Part Number: R0603_200R_1%_0.1W_100PPM; Component Kind: Standard; Component Type: Standard; Pin Count: 2; Status: Preferred; Tolerance: ±1%; Manufacturer Part Number: R0603_200R_1%_0.1W_100PPM; Case: 0603; Mounted: Yes; Socket: No; SMD: Yes; Manufacturer1 Example: NIC COMPONENT; Manufacturer1 ComponentHeight: 0.55mm; HelpURL: \\cern.ch\dfs\Applications\Altium\Datasheets\R0603_NIC_NRC.pdf; Author: CERN DEM JLC; CreateDate: 03-Dec-07; LatestRevisionDate: 13-Mar-08
R15 = R0603_1K_1%_0.1W_100PPM: as R7 on sheet Power; Part Number: R0603_1K_1%_0.1W_100PPM; Component Kind: Standard; Component Type: Standard; Pin Count: 2; Value: 1k; Status: Preferred; Tolerance: ±1%; Manufacturer Part Number: R0603_1K_1%_0.1W_100PPM; Case: 0603; Mounted: Yes; Socket: No; SMD: Yes; Manufacturer1 Example: NIC COMPONENT; Manufacturer1 ComponentHeight: 0.55mm; HelpURL: \\cern.ch\dfs\Applications\Altium\Datasheets\R0603_NIC_NRC.pdf; Author: CERN DEM JLC; CreateDate: 03-Dec-07; LatestRevisionDate: 13-Mar-08
R17 = R0603_10K_1%_0.1W_100PPM: as R11 on sheet Top_Level; Part Number: R0603_10K_1%_0.1W_100PPM; Component Kind: Standard; Component Type: Standard; Pin Count: 2; Value: 10k; Status: Preferred; Tolerance: ±1%; Manufacturer Part Number: R0603_10K_1%_0.1W_100PPM; Case: 0603; Mounted: Yes; Socket: No; SMD: Yes; Manufacturer1 Example: NIC COMPONENT; Manufacturer1 ComponentHeight: 0.55mm; HelpURL: \\cern.ch\dfs\Applications\Altium\Datasheets\R0603_NIC_NRC.pdf; Author: CERN DEM JLC; CreateDate: 03-Dec-07; LatestRevisionDate: 13-Mar-08
RL1 = Relay 1: Relay SPDT,10A - 12VDC 5 Pin; Value: Relay SPDT, 10A, 12V

## Sheet Hardware.SchDoc
size A4; Organization: Q-Tech Design; Address1: Da Nang City; Address2: Viet Nam; DocumentNumber: 6; SheetNumber: 6; SheetTotal: 7
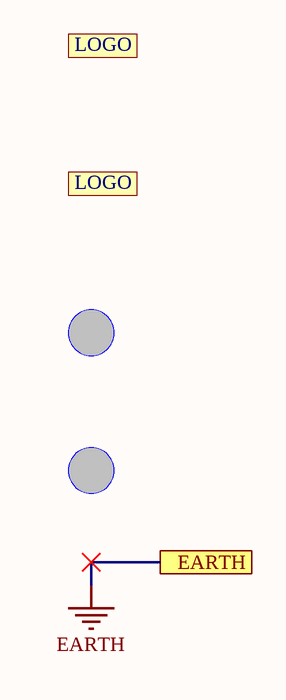
[diagram p7: Hardware.SchDoc]

### Parts
HOLE1  HOLE  [HOLE M3]  (value not drawn)
HOLE2  HOLE  [HOLE M3]  (value not drawn)
LOGO1  LOGO  [LOGO-QTECH]  (value not drawn)
LOGO2  LOGO  [LOGO-QTECH]  (value not drawn)

### Ports
EARTH

### Notes on the sheet
- Page Title:
- Date:
- Title:
- DRE:
- Time:
- Number:
- Sheet
- Rev:
- of
- Q-Tech confidential and proprietary. Restricted access under NDA. Do not reproduce. Store and dispose securely.

### Library data of the parts
HOLE1 HOLE2 = HOLE M3

## Nets that join several sheets
GND: Top_Level (6 pins), MCU_Controller (12 pins), E32_Lora_T30S433MHz (8 pins), Power (12 pins), AP1 (C14AP1.1 J5AP1.3), AP2 (C14AP2.1 J5AP2.3), DS1 (C15DS1.1 J6DS1.3), DS2 (C15DS2.1 J6DS2.3), R1 (IC2R1.2 Q3R1.2 R17R1.1), R2 (IC2R2.2 Q3R2.2 R17R2.1)
P5V-Main: Top_Level (P1.1 R11.1), MCU_Controller (8 pins), E32_Lora_T30S433MHz (C7.2 FB2.1 R2.2), Power (6 pins), R1 (D4R1.1 IC2R1.4 R14R1.1 RL1R1.5), R2 (D4R2.1 IC2R2.4 R14R2.1 RL1R2.5)
P5V-SEN: Power (C13.1 T1.3), AP1 (C14AP1.2 J5AP1.1), AP2 (C14AP2.2 J5AP2.1), DS1 (C15DS1.2 J6DS1.1 R9DS1.2), DS2 (C15DS2.2 J6DS2.1 R9DS2.2)
AUX: MCU_Controller (U1.2), E32_Lora_T30S433MHz (U2.5)
BAT-VSEN: Top_Level (R12.1), Power (C8.1 C9.1 D1.1 IC1.1)
BAT-VSEN-Q: Top_Level (D3.1 R12.2 R13.1), MCU_Controller (U1.23)
CLOSE1: Top_Level (J7.3), R1 (RL1R1.2)
CLOSE2: Top_Level (J8.3), R2 (RL1R2.2)
COM1: Top_Level (J7.2), R1 (RL1R1.1)
COM2: Top_Level (J8.2), R2 (RL1R2.1)
DATA-AP1: MCU_Controller (U1.24), AP1 (J5AP1.2)
DATA-AP2: MCU_Controller (U1.25), AP2 (J5AP2.2)
DATA-DS1: MCU_Controller (U1.10), DS1 (J6DS1.2 R9DS1.1)
DATA-DS2: MCU_Controller (U1.9), DS2 (J6DS2.2 R9DS2.1)
LED: Top_Level (R10.1), MCU_Controller (U1.28)
M0: MCU_Controller (U1.11), E32_Lora_T30S433MHz (U2.1)
M1: MCU_Controller (U1.12), E32_Lora_T30S433MHz (U2.2)
OPEN1: Top_Level (J7.1), R1 (RL1R1.3)
OPEN2: Top_Level (J8.1), R2 (RL1R2.3)
RESET-E32: MCU_Controller (U1.1), E32_Lora_T30S433MHz (R3.1 R4.2)
RL-CTL1: MCU_Controller (U1.26), R1 (R15R1.1)
RL-CTL2: MCU_Controller (U1.27), R2 (R15R2.1)
RXD-E32: MCU_Controller (U1.13), E32_Lora_T30S433MHz (R6.1 U2.3)
RXM: Top_Level (P1.3), MCU_Controller (U1.30)
TXD-E32: MCU_Controller (U1.14), E32_Lora_T30S433MHz (R5.1 U2.4)
TXM: Top_Level (P1.2), MCU_Controller (U1.31)
WAKE: Top_Level (PB2.1 R11.2), MCU_Controller (U1.32)